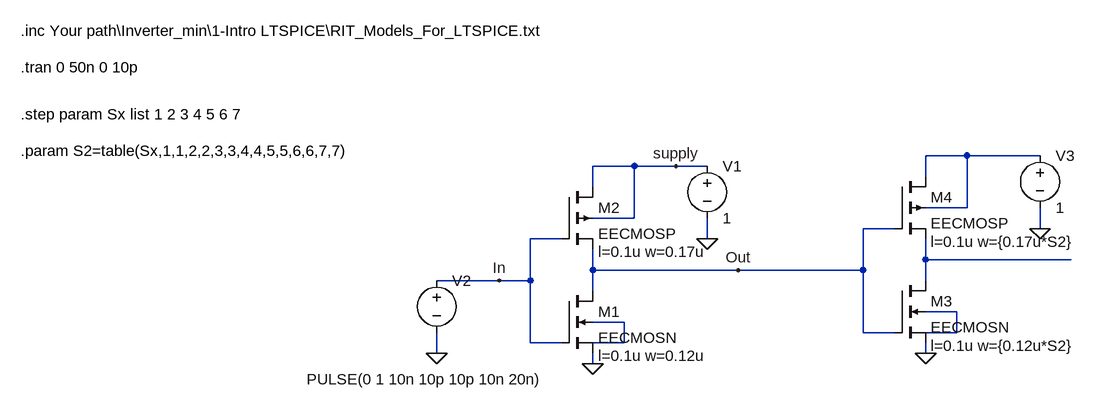
[diagram p0: schematic Inverter_min_con_carico.asc]
Inverter_min_con_carico.asc, the LTspice schematic file:
Version 4
SHEET 1 1776 680
WIRE 1136 -48 1072 -48
WIRE 1248 -48 1136 -48
WIRE 624 -32 560 -32
WIRE 688 -32 624 -32
WIRE 736 -32 688 -32
WIRE 1072 -16 1072 -48
WIRE 560 0 560 -32
WIRE 1136 32 1136 -48
WIRE 1136 32 1072 32
WIRE 624 48 624 -32
WIRE 624 48 560 48
WIRE 1024 64 976 64
WIRE 1248 64 1248 32
WIRE 512 80 464 80
WIRE 736 80 736 48
WIRE 1072 112 1072 80
WIRE 1296 112 1072 112
WIRE 560 128 560 96
WIRE 784 128 560 128
WIRE 976 128 976 64
WIRE 976 128 784 128
WIRE 416 144 320 144
WIRE 464 144 464 80
WIRE 464 144 416 144
WIRE 1072 144 1072 112
WIRE 560 160 560 128
WIRE 1120 192 1072 192
WIRE 608 208 560 208
WIRE 976 224 976 128
WIRE 1024 224 976 224
WIRE 1120 224 1120 192
WIRE 1120 224 1072 224
WIRE 464 240 464 144
WIRE 512 240 464 240
WIRE 608 240 608 208
WIRE 608 240 560 240
WIRE 320 256 320 224
WIRE 1072 256 1072 240
WIRE 560 272 560 256
FLAG 560 272 0
FLAG 736 80 0
FLAG 320 256 0
FLAG 416 144 In
FLAG 688 -32 supply
FLAG 784 128 Out
FLAG 1072 256 0
FLAG 1248 64 0
SYMBOL nmos4 512 160 R0
WINDOW 123 56 100 Left 2
SYMATTR Value2 l=0.1u w=0.12u
SYMATTR InstName M1
SYMATTR Value EECMOSN
SYMBOL pmos4 512 0 R0
WINDOW 123 56 100 Left 2
SYMATTR Value2 l=0.1u w=0.17u
SYMATTR InstName M2
SYMATTR Value EECMOSP
SYMBOL voltage 736 -48 R0
WINDOW 123 0 0 Left 0
WINDOW 39 0 0 Left 0
SYMATTR InstName V1
SYMATTR Value 1
SYMBOL voltage 320 128 R0
WINDOW 3 -200 168 Left 2
WINDOW 123 0 0 Left 0
WINDOW 39 0 0 Left 0
SYMATTR Value PULSE(0 1 10n 10p 10p 10n 20n)
SYMATTR InstName V2
SYMBOL nmos4 1024 144 R0
WINDOW 123 56 100 Left 2
SYMATTR Value2 l=0.1u w={0.12u*S2}
SYMATTR InstName M3
SYMATTR Value EECMOSN
SYMBOL pmos4 1024 -16 R0
WINDOW 123 56 100 Left 2
SYMATTR Value2 l=0.1u w={0.17u*S2}
SYMATTR InstName M4
SYMATTR Value EECMOSP
SYMBOL voltage 1248 -64 R0
WINDOW 123 0 0 Left 0
WINDOW 39 0 0 Left 0
SYMATTR InstName V3
SYMATTR Value 1
TEXT -320 -184 Left 2 !.tran 0 50n 0 10p
TEXT -320 -240 Left 2 !.inc Your path\\Inverter_min\\1-Intro LTSPICE\\RIT_Models_For_LTSPICE.txt
TEXT -320 -112 Left 2 !.step param Sx list 1 2 3 4 5 6 7
TEXT -320 -56 Left 2 !.param S2=table(Sx,1,1,2,2,3,3,4,4,5,5,6,6,7,7)

The netlist it stands for:
* Inverter_min_con_carico.asc
M1 Out In 0 N004 EECMOSN l=0.1u w=0.12u
M2 supply In Out supply EECMOSP l=0.1u w=0.17u
V1 supply 0 1
V2 In 0 PULSE(0 1 10n 10p 10p 10n 20n)
M3 N002 Out 0 N003 EECMOSN l=0.1u w={0.12u*S2}
M4 N001 Out N002 N001 EECMOSP l=0.1u w={0.17u*S2}
V3 N001 0 1
.model NMOS NMOS
.model PMOS PMOS
.lib standard.mos
.tran 0 50n 0 10p
.inc Your path\Inverter_min\1-Intro LTSPICE\RIT_Models_For_LTSPICE.txt
.step param Sx list 1 2 3 4 5 6 7
.param S2=table(Sx,1,1,2,2,3,3,4,4,5,5,6,6,7,7)
.backanno
.end